# Altium project PCB_Project_ESP32.PrjPcb
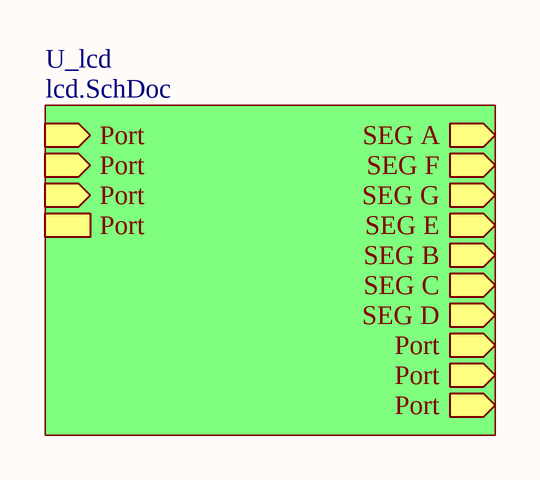
[diagram p0: Sheet9.SchDoc]
5 sheets, 3 parts. Net scope: hierarchical (ports join the sheet entries above them; power ports are global).
Board file: PCB2.PcbDoc
Sheets:
  Sheet9.SchDoc
  Sheet8.SchDoc
    U_temp = temp.SchDoc
  Sheet6.SchDoc
    U_pressiion = pressiion.SchDoc

## Sheet Sheet9.SchDoc
size A4

### Sub-sheets
U_lcd = lcd.SchDoc (file not in this document): Port (in), Port (in), Port (in), SEG A (out), SEG F (out), SEG G (out), SEG E (out), SEG B (out), SEG C (out), SEG D (out), Port (out), Port (out), Port (out), Port

## Sheet Sheet8.SchDoc
size A4
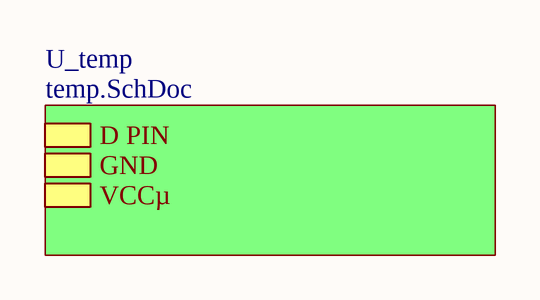
[diagram p1: Sheet8.SchDoc]

### Sub-sheets
U_temp = temp.SchDoc: D PIN, GND, VCCµ

## Sheet temp.SchDoc
size A4
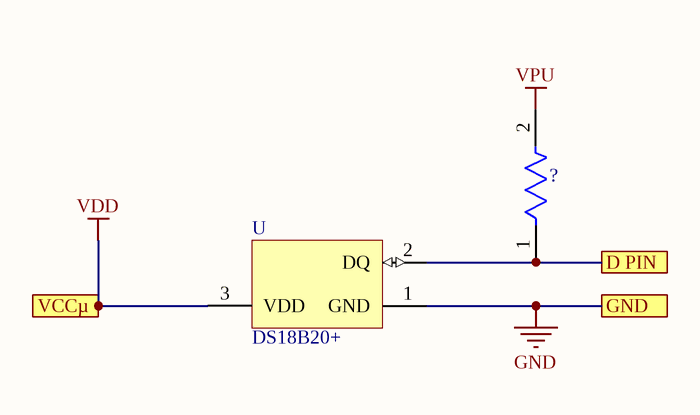
[diagram p2: temp.SchDoc]

### Parts
?  ERA3AEB302V  [FP-ERA3A-IPC_C]  (value not drawn)
U  DS18B20+  [Q3+1]

### Ports
D PIN, GND, VCCµ

### Nets
GND: U.1(GND) ; port GND
VDD: U.3(VDD) ; port VCCµ
VPU: ?.2
Net?_1: ?.1 U.2(DQ) ; port D PIN

### Library data of the parts
? = CMP-2000-00026-2: RES SMD 4.7K OHM 0.1% 1/10W 0603; Voltage Rating: 75V; Resistance: 3kR; Power Rating: 100mW; Temperature Coefficient: 25ppm/°C; Series: ERA-3A; Min Operating Temperature: -55°C; Case Code (Imperial): 0603; Termination: SMD/SMT; Mount: Surface Mount; Package Quantity: 1; Features: Automotive AEC-Q200; Case/Package: 0603; Resistance Tolerance: 0.1%; Height: 0.45mm; Length: 1.6mm; Size Code: 0603; Packaging: Tape and Reel; Number of Terminations: 2; Max Operating Temperature: 155°C; Lead Free: Lead Free; Max Power Dissipation: 100mW; REACH SVHC: No SVHC; Depth: 0.8mm; Resistor Type: Thin Film; Case Code (Metric): 1608; Voltage Rating (DC): 75V; Width: 0.8mm; Construction: Rectangular; Technology: THIN FILM; Number of Pins: 2; Military Standard: Not; Radiation Hardening: No; RoHS Compliant: Yes; Contact Plating: Tin
U = CMP-0253-00003-1: Programmable Resolution Digital Thermometer, 1-Wire Interface, ±0.5°C Accuracy, 3-Pin TO92, -55°C to +125°C, Pb-Free; ComponentLink2URL: http://datasheets.maxim-ic.com/en/ds/DS18B20.pdf; PackageReference: Q3+1; ComponentLink1Description: Manufacturer URL; PackageDescription: TO-92 Package, Body Dia. 4.7mm; Leads 0.51 x 0.51 mm (max), Pb-Free; DatasheetVersion: 2007; Code_JEDEC: TO-226-AA; ComponentLink1URL: http://www.maxim-ic.com; PackageVersion: revB, 2009; ComponentLink2Description: Datasheet

## Sheet Sheet6.SchDoc
size A4
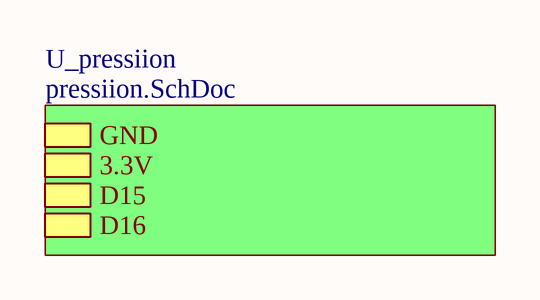
[diagram p3: Sheet6.SchDoc]

### Sub-sheets
U_pressiion = pressiion.SchDoc: GND, 3.3V, D15, D16

## Sheet pressiion.SchDoc
size A4
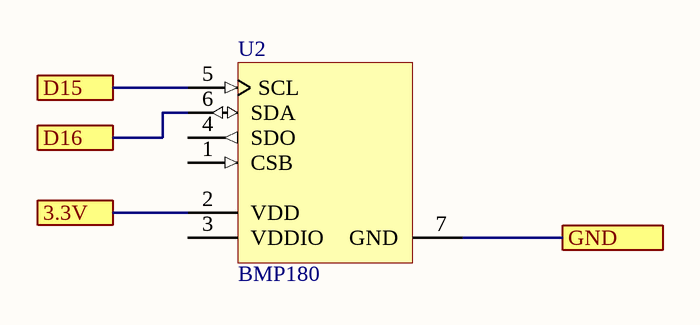
[diagram p4: pressiion.SchDoc]

### Parts
U2  BMP180  [BOSC-BMP180-7_V]

### Ports
3.3V, D15, D16, GND

### Nets
NetU2_2: U2.2(VDD) ; port 3.3V
NetU2_5: U2.5(SCL) ; port D15
NetU2_6: U2.6(SDA) ; port D16
NetU2_7: U2.7(GND) ; port GND

Not connected (* = marked no-connect by the designer): U2 1(CSB) 3(VDDIO) 4(SDO)

### Library data of the parts
U2 = CMP-2000-05074-1: Digital Pressure Sensor, 1.8 to 3.6 V, -40 to 85 degC, 7-Pin LGA, RoHS; Manufacturer: Bosch Sensortec; Output Type: I²C; Other Names: 0273.300.244-1NV / 828-1027-2; Pressure Type: Absolute; Maximum Pressure: 145.04PSI(1000kPa); Voltage - Supply: 1.62V~3.6V; EDA / CAD Models: DownloadfromAcceleratedDesigns; Accuracy: ±2%; Port Style: NoPort; For Use With: 1528-1434-ND / -BMP180BAROMETRICPRESS/TEMP5V / 1528-1435-ND / -L3GD20HLSM303BMP18010DOFIMU / 1568-1260-ND / -SPARKFUNBAROMETRICPRESSURESEN / 1597-1301-ND / -GROVEBAROMETERSENSOR / 1597-1302-ND / -GROVEIMU10DOF / 1471-1581-ND / -10DOFCLICK / 101040003-ND / -XADOWBAROMETERBMP180V1.0 / 101040004-ND / -XADOW-IMU10DOF / 114990245-ND / -BOARDTPHPRESSURETEMPREV.4 / 828-1028-ND / -BMP180SHUTTLEBOARDFORDEVKIT / 103990031-ND / -TPHBOARDTHETEMPERATUREPRESSU; Operating Pressure: 4.35PSI~15.95PSI(30kPa~110kPa); Output: 16~19b; Supplier Device Package: 7-LGA; Operating Temperature: -40degC~85degC; Standard Package: 5,000; Package / Case: 7-VLGA; Manufacturer URL: http://www.bosch-sensortec.com; Category: Sensors,Transducers; Datasheet URL: http://media.digikey.com/pdf/Data%20Sheets/Bosch/BMP180.pdf; Family: PressureSensors,Transducers; Termination Style: PCB; Datasheet Version: Rev. 2.4, 01/2012